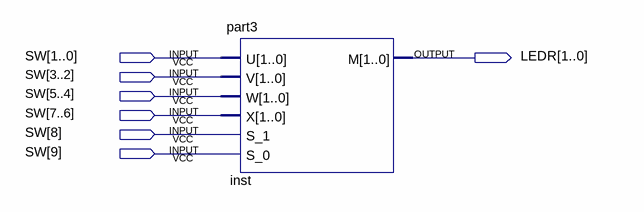
[diagram p0: schematic sheet]
// Quartus schematic part3_sch.bdf as structural Verilog: 1 symbols, 7 pins
module part3_sch (
  input  [9:0] SW,
  output [1:0] LEDR
);

  part3 inst (.U(SW[1:0]), .V(SW[3:2]), .W(SW[5:4]), .X(SW[7:6]), .S_1(SW[8]), .S_0(SW[9]), .M(LEDR));
endmodule
